# EAGLE board module_Rnx_ctrl (EAGLE 6.5.0)
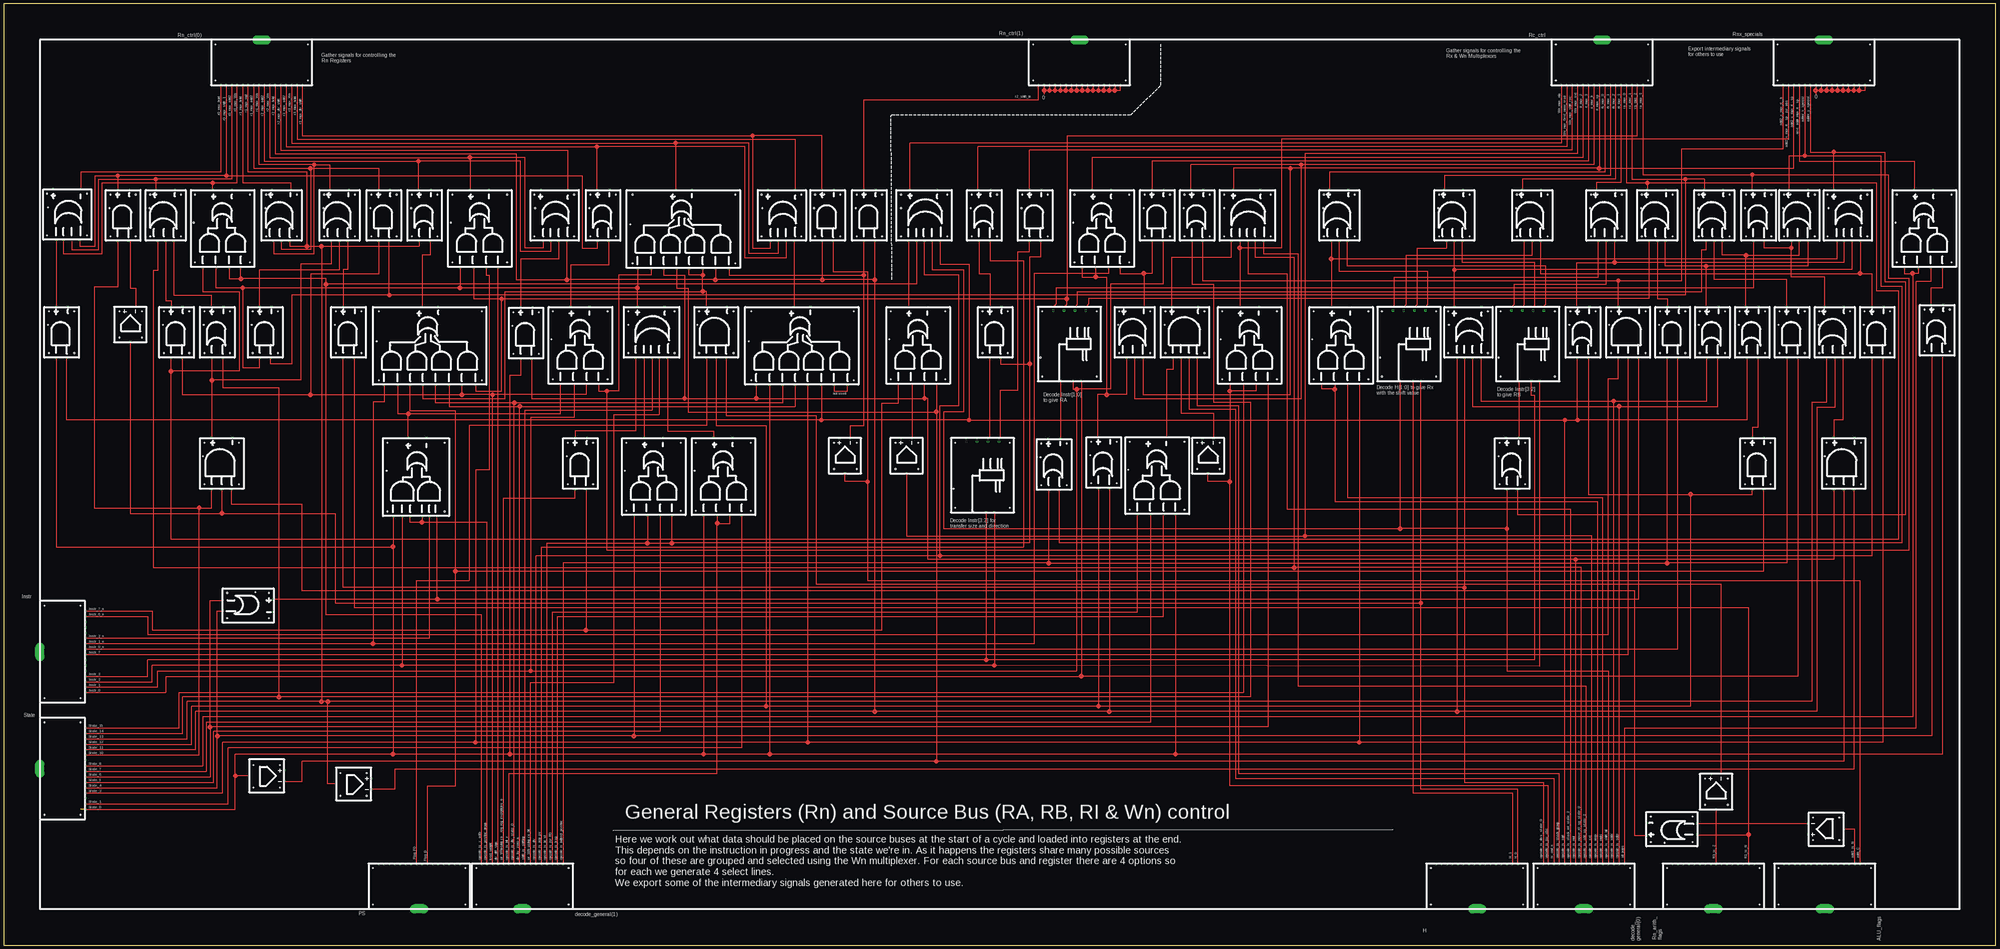
[diagram p21: board, top side]

Size 1397 x 660.4 mm. Coordinates in mm from the lower left corner, seen from the top.
Outline: 0,0 1397,0 1397,660.4 0,660.4 0,0
Copper layers (1*16): Top 0.035mm / dielectric 1.5mm / Bottom 0.035mm
Design rules "default": minimum track width 10mil, minimum drill 24mil, track to track 8mil, track to pad 8mil, pad to pad 8mil, via to via 8mil, smd to smd 8mil, copper to edge 40mil, drill to drill 8mil, minimum pad ring 10mil, minimum via ring 8mil, stop-mask expansion 4mil, vias tented up to drill 0mil, thermal gap 10mil
tKeepout: area 16.3,16.3 to 34.5,34.5; area 1362.5,16.3 to 1380.7,34.5; area 867.2,16.3 to 885.4,34.5; area 16.3,625.9 to 34.5,644.1; area 1362.5,625.9 to 1380.7,644.1; area 867.2,625.9 to 885.4,644.1; area 968.8,625.9 to 987,644.1; area 968.8,16.3 to 987,34.5

## Footprints (pad centres in the part's own frame; a part is rotated, then mirrored left to right if it is on the bottom)
2OR = drill 0.8 square: OUT_M 17.78,-4.445; OUT_P 17.78,4.445; P$1 -17.78,-3.81; P$2 -17.78,3.81 | hole 0.6: -14.605,8.89; 14.605,-8.89; 14.605,8.89; -14.605,-8.89; 5.08,9.525
2X2AND_OR = drill 0.8 square: OUT_M 27.94,-6.985; OUT_P 27.94,6.35; P$1 -26.035,-13.335; P$2 -26.035,-5.08; P$3 -26.035,3.81; P$4 -26.035,13.335 | hole 0.6: -22.86,18.733; 24.765,18.733; -22.86,-19.685; 24.765,-19.685; 5.08,19.685
4OR = drill 0.8 square: 1 -16.51,-8.255; 2 -16.51,-2.54; 3 -16.51,3.175; 4 -16.51,8.255; OUT_M 19.05,-8.89; OUT_P 19.05,10.16 | hole 0.6: -13.335,-13.335; 15.875,-13.335; 15.875,14.605; -13.335,14.605; 6.35,13.97
3OR = drill 0.8 square: OUT_M 16.51,-6.985; OUT_P 16.51,6.35; P$1 -19.05,-6.35; P$2 -19.05,-0.635; P$3 -19.05,5.08 | hole 0.6: -15.875,-11.43; 13.335,-11.43; 13.335,10.16; -15.875,10.16; 3.81,10.795
BUS_SPLIT_DISPLAY = drill 0.8 pad 6.452 long: INPUT 0,15.24 | drill 0.8 square: P$1 -28.575,-16.51; P$2 -24.765,-16.51; P$3 -20.955,-16.51; P$4 -17.145,-16.51; P$5 -13.335,-16.51; P$6 -9.525,-16.51; P$7 -5.715,-16.51; P$8 -1.905,-16.51; P$9 1.905,-16.51; P$10 5.715,-16.51; P$11 9.525,-16.51; P$12 13.335,-16.51; P$13 17.145,-16.51; P$14 20.955,-16.51; P$15 24.765,-16.51; P$16 28.575,-16.51 | hole 0.6: -32.385,-13.335; -32.385,12.065; 32.385,12.065; 32.385,-13.335
5OR = drill 0.8 square: 1 -17.78,-10.795; 2 -17.78,-5.08; 3 -17.78,0; 4 -17.78,5.715; 5 -17.78,11.43; OUT_M 17.78,-8.89; OUT_P 17.78,10.16 | hole 0.6: -14.605,-15.875; 14.605,-15.875; 14.605,16.51; -14.605,16.51; 5.08,16.51
2AND = drill 0.8 square: OUT_M 19.05,-4.445; OUT_P 19.05,3.81; P$1 -16.51,-3.81; P$2 -16.51,3.81 | hole 0.6: -13.335,8.89; 15.875,-8.89; -13.335,-8.89; 15.875,8.89; 6.35,9.525
3AND = drill 0.8 square: OUT_M 16.51,-7.62; OUT_P 16.51,6.985; P$1 -19.05,-6.985; P$2 -19.05,0; P$3 -19.05,6.985 | hole 0.6: -15.875,-12.065; 13.335,-12.065; 13.335,12.065; -15.875,12.065; 3.81,13.335
1BUF = drill 0.8 square: IN -12.7,0; N 12.065,-3.81; P 12.065,3.81 | hole 0.6: -9.525,7.62; -9.525,-8.255; 8.89,-8.255; 8.89,7.62
DECODER4 = drill 0.8 square: A0 -24.765,-7.62; A1 -24.765,-1.905; E -24.765,6.985; N0 24.765,-10.795; N1 24.765,-3.175; N2 24.765,4.445; N3 24.765,12.065; P0 27.305,-10.795; P1 27.305,-3.175; P2 27.305,4.445; P3 27.305,12.065 | hole 0.6: 24.13,19.685; -21.59,19.685; -21.59,-18.415; 24.13,-18.415; -8.255,20.955
2X3AND_OR = drill 0.8 square: OUT_M 27.94,-6.985; OUT_P 27.94,5.715; P$1 -26.67,-14.605; P$2 -26.67,-8.89; P$3 -26.67,-3.81; P$4 -26.67,4.445; P$5 -26.67,10.16; P$6 -26.67,16.51 | hole 0.6: -23.495,-19.685; 24.765,-19.685; 24.765,20.32; -23.495,20.32; 5.08,20.955
4AND = drill 0.8 square: OUT_M 17.145,-8.89; OUT_P 17.145,9.525; P$1 -18.415,-8.255; P$2 -18.415,-2.54; P$3 -18.415,3.175; P$4 -18.415,8.89 | hole 0.6: -15.24,-13.335; 13.97,-13.335; 13.97,13.97; -15.24,13.97; 4.445,14.605
4X2AND_OR = drill 0.8 square: OUT_M 26.67,-6.985; OUT_P 26.67,4.445; P$1 -27.94,-33.02; P$2 -27.94,-23.495; P$3 -27.94,-14.605; P$4 -27.94,-5.08; P$5 -27.94,3.81; P$6 -27.94,12.7; P$7 -27.94,21.59; P$8 -27.94,31.115 | hole 0.6: -24.765,-37.465; 23.495,-37.465; 23.495,34.608; -24.765,34.608; 2.54,36.195

## Placement (x,y rotation side)
CMP1  2OR  [2OR]  771.52,338.45 90 top
CMP2  2X2AND_OR  [2X2AND_OR]  937.26,419.74 90 top
CMP3  4OR  [4OR]  1027.43,428.62 90 top
CMP4  4OR  [4OR]  1293.49,510.54 90 top
CMP5  2X2AND_OR  [2X2AND_OR]  640.72,419.74 90 top
CMP6  2OR  [2OR]  1107.44,429.89 90 top
CMP7  2OR  [2OR]  1057.91,337.82 90 top
CMP8  3OR  [3OR]  935.99,513.08 90 top
CMP9  4OR  [4OR]  45.09,511.18 90 top
CMP10  4OR  [4OR]  386.71,510.54 90 top
CMP11  BUS_SPLIT_DISPLAY  [BUS_SPLIT_DISPLAY]  40.64,205.74 90 top
CMP12  3OR  [3OR]  1016.63,513.08 90 top
CMP13  5OR  [5OR]  645.79,511.81 90 top
CMP14  3OR  [3OR]  1071.24,513.08 90 top
CMP15  2OR  [2OR]  687.71,511.81 90 top
CMP16  2AND  [2AND]  695.33,428.62 90 top
CMP17  2AND  [2AND]  723.26,510.54 90 top
CMP18  BUS_SPLIT_DISPLAY  [BUS_SPLIT_DISPLAY]  40.64,123.83 90 top
CMP19  3OR  [3OR]  1123.32,513.08 90 top
CMP20  2X2AND_OR  [2X2AND_OR]  504.19,327.66 90 top
CMP21  2AND  [2AND]  40.64,428.62 90 top
CMP22  2AND  [2AND]  404.5,336.55 90 top
CMP23  2AND  [2AND]  83.82,510.54 90 top
CMP24  4OR  [4OR]  546.1,510.54 90 top
CMP25  BUS_CONSTRUCT_DISPLAY  [BUS_SPLIT_DISPLAY]  1120.78,619.76 0 top
CMP26  2OR  [2OR]  1198.24,429.89 90 top
CMP27  2OR  [2OR]  1226.18,429.89 90 top
CMP28  3AND  [3AND]  1290.32,339.09 90 top
CMP29  3OR  [3OR]  1283.34,431.17 90 top
CMP30  3OR  [3OR]  1258.57,513.08 90 top
CMP31  1BUF  [1BUF]  88.9,435.61 90 top
CMP32  2OR  [2OR]  736.6,337.19 90 top
CMP33  2AND  [2AND]  1170.31,428.62 90 top
CMP34  2AND  [2AND]  1254.12,428.62 90 top
CMP35  3OR  [3OR]  1158.88,513.08 90 top
CMP36  3OR  [3OR]  1198.88,513.08 90 top
CMP37  2OR  [2OR]  1230.63,511.81 90 top
CMP38  DECODER4  [DECODER4]  1069.34,420.37 90 top
CMP39  DECODER4  [DECODER4]  986.15,420.37 90 top
CMP40  3OR  [3OR]  194.31,513.08 90 top
CMP41  2OR  [2OR]  836.93,511.81 90 top
CMP42  2AND  [2AND]  121.28,428.62 90 top
CMP43  3OR  [3OR]  792.48,431.17 90 top
CMP44  3OR  [3OR]  113.03,513.08 90 top
CMP45  2X2AND_OR  [2X2AND_OR]  769.62,501.65 90 top
CMP46  2AND  [2AND]  808.99,510.54 90 top
CMP47  2OR  [2OR]  171.45,238.12 0 top
CMP48  1BUF  [1BUF]  184.78,118.75 0 top
CMP49  1BUF  [1BUF]  245.75,113.03 0 top
CMP50  2X3AND_OR  [2X3AND_OR]  289.56,327.66 90 top
CMP51  DECODER4  [DECODER4]  748.03,420.37 90 top
CMP52  BUS_CONSTRUCT_DISPLAY  [BUS_SPLIT_DISPLAY]  1276.35,619.76 0 top
CMP53  3AND  [3AND]  499.75,431.17 90 top
CMP54  2AND  [2AND]  266.7,510.54 90 top
CMP55  1BUF  [1BUF]  844.55,343.54 90 top
CMP56  2X2AND_OR  [2X2AND_OR]  153.03,501.65 90 top
CMP57  BUS_SPLIT_DISPLAY  [BUS_SPLIT_DISPLAY]  1108.08,40.64 180 top
CMP58  2X2AND_OR  [2X2AND_OR]  873.12,419.74 90 top
CMP59  2X2AND_OR  [2X2AND_OR]  808.36,328.3 90 top
CMP60  4AND  [4AND]  828.67,430.53 90 top
CMP61  5OR  [5OR]  872.49,511.81 90 top
CMP62  2OR  [2OR]  1355.72,431.17 90 top
CMP63  2OR  [2OR]  1169.67,81.28 180 top
CMP64  2X2AND_OR  [2X2AND_OR]  1346.2,501.65 90 top
CMP65  BUS_SPLIT_DISPLAY  [BUS_SPLIT_DISPLAY]  363.86,40.64 180 top
CMP66  2OR  [2OR]  295.27,511.81 90 top
CMP67  2AND  [2AND]  1229.99,336.55 90 top
CMP68  3OR  [3OR]  234.95,513.08 90 top
CMP69  2AND  [2AND]  183.51,428.62 90 top
CMP70  2X2AND_OR  [2X2AND_OR]  333.38,501.65 90 top
CMP71  2OR  [2OR]  420.37,511.81 90 top
CMP72  3AND  [3AND]  153.03,339.09 90 top
CMP73  2AND  [2AND]  366.39,427.99 90 top
CMP74  2OR  [2OR]  149.86,429.89 90 top
CMP75  2X2AND_OR  [2X2AND_OR]  403.86,419.74 90 top
CMP76  2AND  [2AND]  1313.82,428.62 90 top
CMP77  2AND  [2AND]  577.85,510.54 90 top
CMP78  4X2AND_OR  [4X2AND_OR]  475.62,502.92 90 top
CMP79  4X2AND_OR  [4X2AND_OR]  558.8,421 90 top
CMP80  2X2AND_OR  [2X2AND_OR]  455.3,327.66 90 top
CMP81  4X2AND_OR  [4X2AND_OR]  297.81,421 90 top
CMP82  5OR  [5OR]  454.66,429.89 90 top
CMP83  1BUF  [1BUF]  633.1,343.54 90 top
CMP84  2AND  [2AND]  241.94,428.62 90 top
CMP85  3AND  [3AND]  1139.19,431.17 90 top
CMP86  BUS_SPLIT_DISPLAY  [BUS_SPLIT_DISPLAY]  1198.88,40.64 180 top
CMP87  BUS_SPLIT_DISPLAY  [BUS_SPLIT_DISPLAY]  291.46,40.64 180 top
CMP88  DECODER4  [DECODER4]  687.07,328.3 90 top
CMP89  BUS_CONSTRUCT_DISPLAY  [BUS_SPLIT_DISPLAY]  754.38,619.76 0 top
CMP90  1BUF  [1BUF]  1200.79,107.95 90 top
CMP91  1BUF  [1BUF]  1277.62,81.28 180 top
CMP92  1BUF  [1BUF]  589.91,343.54 90 top
CMP93  2AND  [2AND]  607.06,510.54 90 top
CMP96  BUS_SPLIT_DISPLAY  [BUS_SPLIT_DISPLAY]  1033.14,40.64 180 top
CMP97  BUS_SPLIT_DISPLAY  [BUS_SPLIT_DISPLAY]  1276.98,40.64 180 top
CMP99  BUS_CONSTRUCT_DISPLAY  [BUS_SPLIT_DISPLAY]  180.97,619.76 0 top

## Tracks (layer width: path | path; a pad name or v marks a point on that pad's centre or on a via)
ADD1_RESULT_IS_N
  Top 0.61: CMP97.P$3 1297.94,81.28 CMP91.IN
ADD1_RESULT_IS_P
  Top 0.61: CMP91.N CMP63.P$1
ADD2_X_MUX_RI__H
  Top 0.61: CMP85.OUT_P 1132.2,466.09 | 1132.2,466.09 1176.65,466.09 1176.65,558.8 1247.78,558.8 CMP52.P$1 | CMP41.P$1 840.74,466.09 1132.2,466.09
ADD2_X_MUX_RI__SP
  Top 0.61: CMP25.P$8 1118.87,544.83 | 1118.87,544.83 1255.39,544.83 CMP52.P$3 | 1118.87,544.83 902.34,544.83 | 902.34,544.83 862.33,544.83 CMP61.OUT_P | CMP43.P$1 798.83,386.08 902.34,386.08 902.34,544.83
ADD2_X_MUX_RI__SP__JSR_ABS
  Top 0.61: CMP61.4 866.77,488.95 | 866.77,488.95 CMP58.OUT_P | CMP52.P$2 1251.59,565.15 895.99,565.15 895.99,488.95 866.77,488.95
ADD2_X_MUX_RI__SP__STACK
  Top 0.61: CMP60.OUT_P 819.15,482.6 861.06,482.6 CMP61.5
ADD2_X_MUX_RI_SP__STACK_SET_A_N
  Top 0.61: CMP60.P$4 819.78,403.86 815.34,403.86 CMP59.OUT_M
ADDER_X_MUX_R0
  Top 0.61: CMP26.OUT_P 1193.8,476.25 | 1193.8,476.25 1165.22,476.25 CMP35.P$1 | CMP30.P$1 1264.92,476.25 1193.8,476.25
ADDER_X_MUX_R1
  Top 0.61: CMP27.OUT_P 1221.74,483.87 | 1221.74,483.87 1205.23,483.87 CMP36.P$1 | 1221.74,483.87 1259.2,483.87 CMP30.P$2
ADDER_X_MUX_R1__DIV
  Top 0.61: CMP27.P$1 1229.99,363.22 1226.18,363.22 CMP67.OUT_P
ADDER_X_MUX_R3
  Top 0.61: CMP30.P$3 1253.49,488.95 | 1253.49,488.95 1234.44,488.95 CMP37.P$1 | CMP29.OUT_P 1276.98,468.63 1253.49,468.63 1253.49,488.95
ADDER_X_MUX_R3_SET_A
  Top 0.61: CMP29.P$1 1289.68,368.3 1283.34,368.3 CMP28.OUT_P
ADDER_X_MUX_SPECIAL
  Top 0.61: CMP52.P$5 1263.02,553.72 | 1263.02,553.72 1316.36,553.72 1316.36,462.28 1330.96,462.28 1330.96,281.94 740.41,281.94 CMP32.P$1 | CMP30.OUT_P 1252.22,553.72 1263.02,553.72
ADDER_Y_MUX_R0
  Top 0.61: CMP8.P$3 930.91,481.33 | 930.91,481.33 CMP2.OUT_P | CMP4.4 1285.24,481.33 930.91,481.33
ADDER_Y_MUX_R1
  Top 0.61: CMP4.2 1296.04,473.71 1017.27,473.71 | 1017.27,473.71 CMP12.P$2 | CMP3.OUT_P 1017.27,473.71
ADDER_Y_MUX_R2__DIV
  Top 0.61: CMP4.1 1301.75,471.17 | 1301.75,471.17 1310.01,471.17 CMP76.OUT_P | CMP14.P$1 1077.6,471.17 1301.75,471.17
ADDER_Y_MUX_R3
  Top 0.61: CMP4.3 1290.32,478.79 1129.66,478.79 | 1129.66,478.79 CMP19.P$1 | CMP6.OUT_P 1102.99,478.79 1129.66,478.79
ADDER_Y_MUX_SPECIAL
  Top 0.61: CMP52.P$6 1266.83,556.26 1283.34,556.26 | 1283.34,556.26 1318.89,556.26 1318.89,465.45 1333.5,465.45 1333.5,301.62 1061.72,301.62 CMP7.P$1 | CMP4.OUT_P 1283.34,556.26
ALL_POPS
  Top 0.61: CMP64.P$2 1351.28,465.45 1341.12,465.45 1341.12,152.4 1136.65,152.4 CMP57.P$1
ARITH_C
  Top 0.61: CMP77.P$1 581.66,472.44 605.79,472.44 605.79,325.12 | 605.79,325.12 589.91,325.12 CMP92.IN | 605.79,325.12 605.79,255.91 1301.75,255.91 CMP97.P$2
ARITH_C_N
  Top 0.61: CMP78.P$1 508.63,469.9 603.25,469.9 | 603.25,469.9 CMP93.P$2 | CMP92.N 593.73,364.49 603.25,364.49 603.25,469.9
DIR_SZ_IS_LOAD_BYTE
  Top 0.61: CMP88.P1 691.51,356.87 CMP16.P$2
DIR_SZ_IS_LOAD_WORD
  Top 0.61: CMP88.P0 699.13,356.87 699.13,389.25 711.2,389.25 711.2,486.41 719.46,486.41 CMP17.P$2
DIV_BY_ZERO_N
  Top 0.61: CMP79.P$5 554.99,377.82 361.95,377.82 | CMP81.P$3 312.42,377.82 361.95,377.82 | CMP65.P$9 361.95,377.82
DIV_DIFF_SIGN
  Top 0.61: CMP65.P$13 CMP70.P$1
DIV_SGN_STATE12_NZ_REM
  Top 0.61: CMP78.P$3 490.22,469.9 | 490.22,469.9 480.69,469.9 CMP78.P$4 | CMP53.OUT_P 492.76,458.47 490.22,458.47 | 490.22,458.47 490.22,469.9 | CMP81.P$5 294,383.54 351.79,383.54 351.79,458.47 490.22,458.47
FLAG_D
  Top 0.61: CMP67.P$1 1233.81,262.25 316.87,262.25 | 316.87,262.25 316.87,374.65 285.12,374.65 CMP81.P$6 | CMP87.P$7 297.18,111.76 316.87,111.76 316.87,262.25
FLAG_F0
  Top 0.61: CMP53.P$3 492.76,364.49 326.39,364.49 326.39,255.91 289.56,255.91 CMP87.P$9
H_0
  Top 0.61: CMP96.P$1 1061.72,109.22 993.77,109.22 993.77,240.03 | 993.77,240.03 CMP39.A0 | CMP72.P$2 153.03,302.89 | 153.03,302.89 232.41,302.89 232.41,240.03 993.77,240.03 | CMP31.IN 88.9,302.89 153.03,302.89
H_0_N
  Top 0.61: CMP23.P$1 88.9,494.03 88.9,461.01 92.71,461.01 CMP31.N
H_1
  Top 0.61: CMP39.A1 988.06,106.68 1057.91,106.68 CMP96.P$2
INSTR_0
  Top 0.61: CMP11.P$1 113.67,177.16 113.67,188.59 755.65,188.59 | CMP51.A0 755.65,188.59 | CMP34.P$1 1257.93,188.59 755.65,188.59
INSTR_0_N
  Top 0.61: CMP11.P$9 1174.12,207.65 CMP33.P$1
INSTR_1
  Top 0.61: CMP11.P$2 107.95,180.97 107.95,192.41 369.57,192.41 | CMP51.A1 749.93,389.89 752.48,389.89 | 752.48,389.89 752.48,192.41 369.57,192.41 | CMP46.P$1 812.8,463.55 775.97,463.55 775.97,389.89 752.48,389.89 | CMP75.P$3 400.05,370.2 369.57,370.2 369.57,192.41
INSTR_1_N
  Top 0.61: 259.08,211.46 722.63,211.46 722.63,471.17 774.7,471.17 CMP45.P$2 | 259.08,211.46 CMP11.P$10 | CMP81.P$8 266.7,381 259.08,381 259.08,211.46
INSTR_2
  Top 0.61: 694.69,196.22 1076.96,195.58 CMP38.A0 | 694.69,196.22 279.4,196.22 | 279.4,196.22 104.14,196.22 104.14,184.78 CMP11.P$3 | CMP88.A0 694.69,196.22 | CMP50.P$5 279.4,196.22
INSTR_2_N
  Top 0.61: CMP50.P$2 298.45,215.26 CMP11.P$11
INSTR_3
  Top 0.61: 688.98,200.03 1073.79,200.03 1073.79,385.44 1071.24,385.44 CMP38.A1 | 688.98,200.03 100.97,200.03 100.97,188.59 CMP11.P$4 | CMP88.A1 688.98,200.03
INSTR_6_N
  Top 0.61: CMP11.P$15 100.97,230.5 100.97,217.81 1125.22,217.81 1125.22,397.51 1132.2,397.51 CMP85.P$3
INSTR_7
  Top 0.61: CMP11.P$8 1139.19,203.84 CMP85.P$2
INSTR_7_N
  Top 0.61: CMP11.P$16 104.14,234.31 104.14,220.98 408.31,220.98 | 408.31,220.98 615.95,220.98 615.95,380.37 627.38,380.37 CMP5.P$4 | CMP22.P$1 408.31,220.98
IS_END_N
  Top 0.61: CMP60.P$2 831.22,375.92 863.6,375.92 863.6,116.84 1087.12,116.84 CMP57.P$14
IS_STATE_0_4
  Top 0.61: CMP64.P$1 1359.54,461.01 1351.28,461.01 CMP62.OUT_P
IS_STATE_4_6
  Top 0.61: CMP85.P$1 1146.17,242.57 304.17,242.57 | 304.17,242.57 304.17,299.72 303.53,300.36 CMP50.P$1 | 304.17,242.57 CMP47.OUT_P
LOAD_WEIGHT
  Top 0.61: CMP42.P$1 125.09,386.08 215.26,386.08 | 215.26,386.08 321.31,386.08 | CMP75.P$2 408.94,386.08 342.9,386.08 | CMP54.P$2 262.89,470.54 215.26,470.54 215.26,386.08 | CMP81.P$2 321.31,386.08 | 342.9,386.08 321.31,386.08 | CMP65.P$14 342.9,386.08
MAIN_RN_INPUT_MUX_0XT_READ
  Top 0.61: CMP25.P$2 1096.01,560.07 683.26,560.07 CMP15.OUT_P
MAIN_RN_INPUT_MUX_0XT_READ__LOAD_BYTE
  Top 0.61: CMP15.P$2 683.89,471.17 691.51,471.17 CMP16.OUT_P
MAIN_RN_INPUT_MUX_ALU
  Top 0.61: CMP25.P$1 1092.2,562.61 635.63,562.61 CMP13.OUT_P
MAIN_RN_INPUT_MUX_ALU__SET_A
  Top 0.61: CMP13.5 CMP5.OUT_P
MAIN_RN_INPUT_MUX_SHIFT_RAC
  Top 0.61: CMP25.P$3 1099.82,557.53 719.46,557.53 CMP17.OUT_P
N$2
  Top 0.61: CMP52.P$7 1270.63,599.44 | 1270.63,599.44 1270.63,596.9 | CMP52.P$16 1304.92,599.44 1301.12,599.44 | 1301.12,599.44 1297.31,599.44 | 1297.31,599.44 1293.49,599.44 | 1293.49,599.44 1289.68,599.44 | 1289.68,599.44 1285.88,599.44 | 1285.88,599.44 1282.07,599.44 | 1282.07,599.44 1278.26,599.44 | 1278.26,599.44 1274.44,599.44 | 1274.44,599.44 1270.63,599.44 | CMP52.P$8 1274.44,599.44 | CMP52.P$9 1278.26,599.44 | CMP52.P$10 1282.07,599.44 | CMP52.P$11 1285.88,599.44 | CMP52.P$12 1289.68,599.44 | CMP52.P$13 1293.49,599.44 | CMP52.P$14 1297.31,599.44 | CMP52.P$15 1301.12,599.44
N$3
  Top 0.61: CMP89.P$2 729.62,599.44 | 729.62,599.44 729.62,596.9 | CMP89.P$3 733.42,599.44 | 733.42,599.44 729.62,599.44 | CMP89.P$16 782.96,599.44 779.14,599.44 | 779.14,599.44 775.34,599.44 | 775.34,599.44 771.52,599.44 | 771.52,599.44 767.72,599.44 | 767.72,599.44 763.9,599.44 | 763.9,599.44 760.1,599.44 | 760.1,599.44 756.28,599.44 | 756.28,599.44 752.48,599.44 | 752.48,599.44 748.66,599.44 | 748.66,599.44 744.86,599.44 | 744.86,599.44 741.04,599.44 | 741.04,599.44 737.24,599.44 | 737.24,599.44 733.42,599.44 | CMP89.P$4 737.24,599.44 | CMP89.P$5 741.04,599.44 | CMP89.P$6 744.86,599.44 | CMP89.P$7 748.66,599.44 | CMP89.P$8 752.48,599.44 | CMP89.P$9 756.28,599.44 | CMP89.P$10 760.1,599.44 | CMP89.P$11 763.9,599.44 | CMP89.P$12 767.72,599.44 | CMP89.P$13 771.52,599.44 | CMP89.P$14 775.34,599.44 | CMP89.P$15 779.14,599.44
N$34
  Top 0.61: CMP79.P$2 582.29,388.62 591.82,388.62 CMP79.P$1
NEXT_ADDR_MUX_RI__SP
  Top 0.61: CMP52.P$4 1259.2,549.91 1339.85,549.91 CMP64.OUT_P
NEXT_R0_MUX_ADD2
  Top 0.61: CMP99.P$3 160.02,537.21 106.68,537.21 | CMP9.2 47.62,487.68 66.67,487.68 66.67,537.21 106.68,537.21 | 106.68,537.21 CMP44.OUT_P
NEXT_R0_MUX_ADD2__WEIGHT
  Top 0.61: CMP44.P$2 113.67,452.12 117.47,452.12 CMP42.OUT_P
NEXT_R0_MUX_HOLD
  Top 0.61: CMP99.P$1 152.4,542.29 53.98,542.29 CMP9.OUT_M
NEXT_R0_MUX_MAIN
  Top 0.61: CMP56.OUT_P 146.69,534.67 | 146.69,534.67 163.83,534.67 CMP99.P$4 | CMP9.3 41.91,485.14 69.22,485.14 69.22,534.67 146.69,534.67
NEXT_R1_MUX_ADD2
  Top 0.61: CMP99.P$7 175.26,544.83 215.26,544.83 | 215.26,544.83 215.26,487.68 194.94,487.68 CMP40.P$2 | 215.26,544.83 262.89,544.83 CMP54.OUT_P
NEXT_R1_MUX_HOLD
  Top 0.61: CMP99.P$5 167.64,534.67 201.29,534.67 CMP40.OUT_M
NEXT_R1_MUX_MAIN
  Top 0.61: CMP40.P$3 189.23,485.14 217.81,485.14 217.81,547.37 | 217.81,547.37 179.07,547.37 CMP99.P$8 | 217.81,547.37 228.6,547.37 CMP68.OUT_P
NEXT_R1_MUX_MAIN__DIV
  Top 0.61: CMP68.P$1 241.3,473.71 238.12,473.71 CMP84.OUT_P
NEXT_R1_MUX_MAIN__RAC
  Top 0.61: CMP69.OUT_P 179.71,473.71 235.59,473.71 CMP68.P$2
NEXT_R2_MUX_ADD2
  Top 0.61: CMP99.P$9 182.88,549.91 290.83,549.91 | 290.83,549.91 CMP66.OUT_P | CMP10.3 383.54,486.41 362.58,486.41 362.58,549.91 290.83,549.91
NEXT_R2_MUX_ADD2__A
  Top 0.61: CMP66.P$1 299.08,483.87 293.37,483.87 CMP81.OUT_P
NEXT_R2_MUX_CLEAR
  Top 0.61: CMP10.2 389.25,481.33 362.58,481.33 CMP73.OUT_P
NEXT_R2_MUX_HOLD
  Top 0.61: CMP99.P$12 194.31,557.53 395.61,557.53 CMP10.OUT_M
NEXT_R2_MUX_MAIN
  Top 0.61: CMP99.P$10 186.69,552.45 327.02,552.45 | 327.02,552.45 CMP70.OUT_P | CMP10.4 378.46,488.95 365.76,488.95 365.76,552.45 327.02,552.45
NEXT_R3_MUX_ADD2
  Top 0.61: CMP99.P$13 198.12,560.07 415.93,560.07 | 415.93,560.07 CMP71.OUT_P | CMP24.2 548.64,481.96 520.07,481.96 520.07,560.07 415.93,560.07
NEXT_R3_MUX_ADD2__A
  Top 0.61: CMP71.P$1 424.18,476.88 397.51,476.88 CMP75.OUT_P
NEXT_R3_MUX_CLEAR
  Top 0.61: CMP24.1 CMP79.OUT_P
NEXT_R3_MUX_DIV_SHIFT_R3
  Top 0.61: CMP99.P$16 209.55,567.69 525.14,567.69 | 525.14,567.69 525.14,488.95 537.85,488.95 CMP24.4 | CMP77.OUT_P 574.04,567.69 525.14,567.69
NEXT_R3_MUX_HOLD
  Top 0.61: CMP99.P$15 205.74,565.15 554.99,565.15 CMP24.OUT_M
NEXT_R3_MUX_MAIN
  Top 0.61: CMP99.P$14 201.93,562.61 471.17,562.61 | 471.17,562.61 CMP78.OUT_P | CMP24.3 542.92,485.14 522.61,485.14 522.61,562.61 471.17,562.61
OPCODE_IS_ADD_SP_STATE_2
  Top 0.61: CMP61.1 883.28,485.14 907.41,485.14 907.41,181.61 1109.98,181.61 CMP57.P$8
OPCODE_IS_ADDX
  Top 0.61: CMP3.1 1035.68,381.63 1129.03,381.63 | 1129.03,381.63 1194.43,381.63 CMP26.P$2 | CMP57.P$3 1129.03,381.63
OPCODE_IS_DIV
  Top 0.61: CMP76.P$2 1310.01,273.05 656.59,273.05 | 656.59,273.05 656.59,378.46 669.92,378.46 669.92,469.9 645.79,469.9 CMP13.3 | 656.59,273.05 373.38,273.05 CMP65.P$6
OPCODE_IS_DIV_STATE_0
  Top 0.61: CMP79.P$6 546.1,380.37 358.14,380.37 | 358.14,380.37 302.89,380.37 CMP81.P$4 | CMP65.P$10 358.14,380.37
OPCODE_IS_DIVS_STATE_0
  Top 0.61: CMP3.3 1024.26,250.82 | 1024.26,250.82 238.12,250.82 CMP84.P$2 | 1024.26,250.82 1024.26,114.3 1079.5,114.3 CMP57.P$16
OPCODE_IS_INDIRECT_POSTINC
  Top 0.61: CMP32.P$2 732.79,267.97 | 732.79,267.97 1166.49,267.97 | 1166.49,267.97 CMP33.P$2 | CMP34.P$2 1250.32,267.97 1166.49,267.97 | 732.79,267.97 392.43,267.97 CMP65.P$1
OPCODE_IS_JSR_ABS
  Top 0.61: CMP58.P$4 859.79,388.62 | 859.79,388.62 859.79,325.12 | 859.79,325.12 844.55,325.12 CMP55.IN | CMP58.P$2 878.21,388.62 859.79,388.62 | CMP57.P$15 1083.31,111.76 859.79,111.76 859.79,325.12
OPCODE_IS_JSR_ABS_N
  Top 0.61: CMP60.P$3 825.5,373.38 848.36,373.38 CMP55.N
OPCODE_IS_JSR_R0
  Top 0.61: CMP65.P$3 384.81,233.68 795.02,233.68 CMP59.P$4
OPCODE_IS_LD_ST
  Top 0.61: CMP17.P$1 727.08,482.6 719.46,482.6 719.46,407.67 | 719.46,407.67 719.46,281.94 468.63,281.94 | 468.63,281.94 CMP80.P$1 | CMP16.P$1 699.13,407.67 719.46,407.67 | CMP80.P$3 451.49,281.94 | 451.49,281.94 468.63,281.94 | CMP65.P$4 381,281.94 451.49,281.94
OPCODE_IS_LDI_X
  Top 0.61: CMP20.P$3 500.38,295.91 | 500.38,295.91 509.27,295.91 CMP20.P$2 | CMP65.P$11 354.33,120.65 500.38,120.65 500.38,295.91
OPCODE_IS_MOVE_R0_SP_STATE_0
  Top 0.61: CMP61.2 877.57,482.6 904.88,482.6 904.88,264.8 | CMP44.P$3 107.95,473.07 104.78,473.07 104.78,264.8 904.88,264.8 | CMP57.P$9 1106.17,264.8 904.88,264.8
OPCODE_IS_MUL
  Top 0.61: CMP28.P$3 1283.34,270.51 1102.36,270.51 | 1102.36,270.51 648.34,270.51 648.34,383.54 645.79,383.54 | 645.79,383.54 CMP5.P$2 | CMP79.P$8 527.68,383.54 | 527.68,383.54 645.79,383.54 | CMP73.P$1 370.2,383.54 477.52,383.54 | 477.52,383.54 527.68,383.54 | CMP78.P$6 462.92,469.9 477.52,469.9 477.52,383.54 | CMP57.P$10 1102.36,270.51
OPCODE_IS_MULS
  Top 0.61: CMP2.P$2 942.34,313.69 1121.41,313.69 CMP57.P$5
OPCODE_IS_NEGX
  Top 0.61: CMP2.P$4 923.92,389.89 933.45,389.89 | CMP2.P$3 933.45,389.89 | 933.45,389.89 933.45,311.15 1117.6,311.15 CMP57.P$6
OPCODE_IS_POP_PS
  Top 0.61: CMP15.P$1 691.51,480.06 715.01,480.06 715.01,279.4 377.19,279.4 CMP65.P$5
OPCODE_IS_POSTINC_GROUP
  Top 0.61: 293.37,296.55 285.12,296.55 CMP50.P$4 | CMP50.P$3 293.37,296.55 | CMP65.P$15 339.09,296.55 293.37,296.55
OPCODE_IS_SHIFT_BIT
  Top 0.61: CMP39.E 979.17,292.1 | CMP7.P$2 1054.1,292.1 | 1054.1,292.1 979.17,292.1 | CMP13.2 650.88,473.71 673.1,473.71 673.1,374.01 659.13,374.01 659.13,292.1 979.17,292.1 | 1054.1,292.1 1054.1,192.41 1125.22,192.41 CMP57.P$4
OPCODE_IS_SQRT
  Top 0.61: CMP13.1 656.59,477.52 676.91,477.52 676.91,368.3 | 676.91,368.3 1094.74,368.3 | 1094.74,368.3 1103.63,368.3 | 1103.63,368.3 CMP6.P$2 | 676.91,368.3 573.4,368.3 | 573.4,368.3 44.45,368.3 CMP21.P$1 | CMP79.P$3 573.4,368.3 | CMP27.P$2 1222.38,368.3 1103.63,368.3 | CMP57.P$12 1094.74,368.3
OPCODE_IS_STACK_GROUP
  Top 0.61: CMP60.P$1 836.93,378.46 866.14,378.46 866.14,120.02 1090.93,120.02 CMP57.P$13
OPCODE_IS_STACK_REL_STATE_2
  Top 0.61: CMP61.3 872.49,471.17 899.79,471.17 899.79,306.07 1098.55,306.07 CMP57.P$11
OPCODE_IS_SUBX
  Top 0.61: CMP3.2 1029.97,377.82 1132.84,377.82 | 1132.84,377.82 1202.06,377.82 CMP26.P$1 | CMP57.P$2 1132.84,377.82
OPCODE_IS_SXT
  Top 0.61: CMP25.P$4 1103.63,554.99 912.5,554.99 912.5,287.02 | CMP83.IN 633.1,287.02 912.5,287.02 | CMP57.P$7 1113.79,287.02 912.5,287.02
OPCODE_IS_SXT_N
  Top 0.61: CMP5.P$3 CMP83.N
OPCODE_IS_TRAP
  Top 0.61: CMP65.P$2 388.62,230.5 813.43,230.5 CMP59.P$2
OPCODE_IS_X_ARITH
  Top 0.61: CMP13.4 640.08,463.55 226.06,463.55 | 166.37,467.36 CMP56.P$1 | CMP56.P$2 158.12,467.36 166.37,467.36 | 226.06,463.55 226.06,467.36 166.37,467.36 | CMP65.P$16 335.28,231.78 226.06,231.78 226.06,463.55
R1_IS_N
  Top 0.61: CMP84.P$1 245.75,236.85 1223.64,236.85 1223.64,77.47 | CMP86.P$2 1223.64,77.47 | CMP63.P$2 1223.64,77.47
R2_SHIFT_IN
  Top 0.61: CMP93.OUT_P 603.25,593.09 725.8,593.09 CMP89.P$1
R3_IS_NZ
  Top 0.61: CMP53.P$1 506.73,371.48 569.6,371.48 569.6,253.37 1204.6,253.37 CMP90.N
R3_IS_Z
  Top 0.61: CMP86.P$8 CMP90.IN
RA_MUX_0_RC
  Top 0.61: CMP35.P$2 1159.51,453.39 1166.49,453.39 CMP33.OUT_P
RA_MUX_1_RC
  Top 0.61: CMP34.OUT_P 1250.32,466.73 1199.52,466.73 CMP36.P$2
RA_MUX_NORM_EN
  Top 0.61: CMP51.E CMP32.OUT_M
RA_NORM_0
  Top 0.61: CMP35.P$3 1153.8,453.39 760.73,453.39 760.73,449.58 CMP51.P0
RA_NORM_1
  Top 0.61: CMP51.P1 753.11,449.58 753.11,458.47 1190.62,458.47 1190.62,487.68 1193.8,487.68 CMP36.P$3
RA_NORM_2
  Top 0.61: CMP51.P2 745.49,449.58 745.49,453.39 | CMP25.P$15 1145.54,567.69 745.49,567.69 745.49,453.39 | CMP70.P$3 329.56,453.39 349.25,453.39 | 349.25,453.39 745.49,453.39 | CMP81.P$1 330.83,388.62 349.25,388.62 349.25,453.39
RA_NORM_3
  Top 0.61: CMP37.P$2 1226.82,461.01 737.87,461.01 737.87,449.58 CMP51.P3
RAC_MUX_0
  Top 0.61: CMP56.P$4 139.7,458.47 165.1,458.47 165.1,402.59 117.47,402.59 | 117.47,402.59 CMP42.P$2 | CMP25.P$13 1137.92,534.67 1152.53,534.67 | 1152.53,534.67 CMP35.OUT_P | 1152.53,534.67 1313.18,534.67 1313.18,459.11 1328.42,459.11 1328.42,284.48 117.47,284.48 117.47,402.59
RAC_MUX_1
  Top 0.61: CMP25.P$14 1141.73,537.21 1179.19,537.21 | CMP36.OUT_P 1192.53,537.21 1179.19,537.21 | 1179.19,537.21 1179.19,455.93 270.51,455.93 | 270.51,455.93 CMP54.P$1 | 270.51,455.93 201.93,455.93 201.93,407.67 187.32,407.67 CMP69.P$1
RAC_MUX_3
  Top 0.61: CMP25.P$16 1149.35,540.38 1226.18,540.38 | 1226.18,540.38 1321.43,540.38 1321.43,468 1336.04,468 1336.04,276.86 422.91,276.86 422.91,388.62 | CMP75.P$1 417.19,388.62 422.91,388.62 | CMP37.OUT_P 1226.18,540.38 | CMP78.P$7 454.02,469.9 431.17,469.9 431.17,388.62 422.91,388.62
RB_MUX_0
  Top 0.61: CMP25.P$9 1122.68,542.29 929.64,542.29 CMP8.OUT_P
RB_MUX_1
  Top 0.61: CMP25.P$10 1126.49,539.75 1010.28,539.75 CMP12.OUT_P
RB_MUX_2
  Top 0.61: CMP25.P$11 1130.3,537.21 1064.89,537.21 CMP14.OUT_P
RB_MUX_3
  Top 0.61: CMP25.P$12 1134.11,534.67 1116.96,534.67 CMP19.OUT_P
RB_MUX_NORM_EN
  Top 0.61: CMP38.E CMP7.OUT_M
RB_NORM_0
  Top 0.61: CMP38.P0 1080.13,448.31 1081.4,449.58 1081.4,476.25 942.34,476.25 CMP8.P$1
RB_NORM_1
  Top 0.61: CMP38.P1 1073.79,448.94 1073.79,478.79 1022.99,478.79 CMP12.P$1
RB_NORM_2
  Top 0.61: CMP14.P$3 1066.16,448.94 CMP38.P2
RB_NORM_3
  Top 0.61: CMP38.P3 1059.18,449.58 1059.18,463.55 1123.95,463.55 CMP19.P$2
RB_SHIFT_0
  Top 0.61: CMP39.P0 998.86,449.58 998.86,472.44 936.62,472.44 CMP8.P$2
RB_SHIFT_1
  Top 0.61: CMP12.P$3 1011.55,488.95 991.24,488.95 991.24,449.58 CMP39.P1
RB_SHIFT_2
  Top 0.61: CMP39.P2 983.62,449.58 983.62,483.87 1071.88,483.87 CMP14.P$2
RB_SHIFT_3
  Top 0.61: CMP39.P3 975.36,448.94 975.36,468.63 1118.23,468.63 CMP19.P$3
RI_MUX_2_QUAL
  Top 0.61: CMP25.P$5 1107.44,552.45 763.27,552.45 CMP45.OUT_P
RI_MUX_3_QUAL
  Top 0.61: CMP25.P$6 1111.25,549.91 805.18,549.91 CMP46.OUT_P
RI_MUX_H
  Top 0.61: CMP25.P$7 1115.06,547.37 909.96,547.37 | 909.96,547.37 832.49,547.37 CMP41.OUT_P | CMP43.P$2 793.12,383.54 909.96,383.54 909.96,547.37
RI_MUX_R2
  Top 0.61: CMP45.P$4 756.28,468.63 765.81,468.63 | 765.81,468.63 CMP45.P$3 | 765.81,468.63 773.43,468.63 773.43,386.08 | 773.43,386.08 767.08,386.08 CMP1.OUT_P | CMP43.P$3 787.4,386.08 773.43,386.08
RI_MUX_SPECIAL_N
  Top 0.61: CMP46.P$2 805.18,471.17 799.47,471.17 | 799.47,471.17 CMP43.OUT_M | CMP45.P$1 782.96,471.17 799.47,471.17
SHIFT_IS_SHIFTING
  Top 0.61: CMP82.3 454.66,375.29 365.76,375.29 CMP65.P$8
SQRT_CONDITIONAL
  Top 0.61: CMP63.OUT_P 1143.63,76.83 1143.63,248.28 209.55,248.28 209.55,309.25 160.02,309.25 CMP72.P$1
SQRT_ODD_CONDITIONAL
  Top 0.61: CMP74.P$2 146.05,396.24 | 146.05,396.24 CMP72.OUT_P | CMP68.P$3 229.87,477.52 208.28,477.52 208.28,396.24 146.05,396.24
SQRT_ODD_CONDITIONAL_MUL_14
  Top 0.61: CMP44.P$1 119.38,455.93 145.41,455.93 CMP74.OUT_P
SQRT_STATE_0
  Top 0.61: CMP9.4 CMP21.OUT_P
SQRT_STATE_10_EVEN_CYCLE
  Top 0.61: CMP9.1 53.34,490.22 64.14,490.22 64.14,539.75 80.01,539.75 | 80.01,539.75 CMP23.OUT_P | CMP99.P$2 156.21,539.75 | 156.21,539.75 80.01,539.75 | 156.21,539.75 405.76,539.75 405.76,488.95 416.56,488.95 CMP71.P$2
STATE_0  (1 unrouted)
  Top 0.61: 821.69,133.99 1359.54,133.99 CMP62.P$1 | 821.69,133.99 537.21,133.99 | 537.21,133.99 490.86,133.99 | 490.86,133.99 354.96,133.99 | 354.96,133.99 273.05,133.99 | 273.05,133.99 162.56,133.99 162.56,118.75 | CMP18.P$1 162.56,95.25 162.56,118.75 | CMP73.P$2 362.58,399.42 354.96,399.42 354.96,133.99 | CMP50.P$6 273.05,279.4 | 273.05,279.4 273.05,133.99 | CMP79.P$7 537.21,133.99 | CMP20.P$4 490.86,133.99 | CMP59.P$1 821.69,133.99 | CMP21.P$2 36.83,279.4 273.05,279.4 | CMP48.IN 162.56,118.75
STATE_0_N
  Top 0.61: 654.05,128.91 1290.32,128.91 CMP28.P$2 | 654.05,128.91 209.55,128.91 209.55,114.94 CMP48.N | CMP78.P$5 471.81,461.01 480.06,461.01 480.06,374.01 654.05,374.01 | 654.05,374.01 654.05,128.91 | CMP5.P$1 654.05,374.01
STATE_1
  Top 0.61: CMP18.P$2 157.48,99.06 157.48,138.43 517.52,138.43 CMP20.P$1
STATE_3
  Top 0.61: 950.6,142.24 1317.62,142.24 CMP76.P$1 | 950.6,142.24 563.88,142.24 | 563.88,142.24 330.83,142.24 | 330.83,142.24 153.67,142.24 153.67,106.68 CMP18.P$4 | CMP2.P$1 950.6,142.24 | CMP70.P$2 338.45,469.9 340.36,469.9 340.36,333.38 330.83,333.38 330.83,142.24 | CMP79.P$4 563.88,142.24
STATE_4
  Top 0.61: 441.96,146.69 1351.91,146.69 CMP62.P$2 | 441.96,146.69 149.86,146.69 | CMP18.P$5 149.86,110.49 149.86,146.69 | CMP80.P$4 441.96,146.69 | 149.86,146.69 149.86,234.31 CMP47.P$1
STATE_5
  Top 0.61: CMP18.P$6 147.32,114.3 147.32,149.86 460.38,149.86 CMP80.P$2
STATE_6
  Top 0.61: 144.78,153.03 886.46,153.03 CMP58.P$1 | CMP18.P$7 144.78,118.11 144.78,153.03 | 144.78,153.03 144.78,241.94 CMP47.P$2
STATE_7
  Top 0.61: CMP18.P$8 142.24,121.92 142.24,156.21 804.54,156.21 CMP59.P$3
STATE_8
  Top 0.61: CMP64.P$4 1332.87,471.17 1338.58,471.17 | 1338.58,471.17 1338.58,160.02 139.7,160.02 139.7,125.73 CMP18.P$9 | CMP64.P$3 1342.39,471.17 1338.58,471.17
STATE_10
  Top 0.61: CMP18.P$11 137.16,133.35 137.16,306.7 | CMP23.P$2 80.01,461.64 63.5,461.64 63.5,306.7 137.16,306.7 | 137.16,306.7 146.05,306.7 CMP72.P$3
STATE_11
  Top 0.61: 1019.17,163.83 775.34,163.83 | 775.34,163.83 610.87,163.83 | 610.87,163.83 134.62,163.83 134.62,137.16 CMP18.P$12 | CMP99.P$11 190.5,554.99 359.41,554.99 359.41,466.73 394.97,466.73 | 394.97,466.73 CMP10.1 | CMP77.P$2 574.04,466.73 | 574.04,466.73 499.11,466.73 | 499.11,466.73 394.97,466.73 | CMP78.P$2 499.11,466.73 | CMP3.4 1019.17,163.83 | CMP93.P$1 610.87,466.73 | 610.87,466.73 574.04,466.73 | 610.87,466.73 610.87,163.83 | CMP1.P$1 775.34,163.83 | CMP29.P$2 1283.97,377.19 1271.27,377.19 1271.27,163.83 1019.17,163.83
STATE_12
  Top 0.61: 767.72,167.64 1183.01,167.64 1183.01,316.23 | 767.72,167.64 534.67,167.64 | 534.67,167.64 132.08,167.64 132.08,140.97 CMP18.P$13 | CMP1.P$2 767.72,167.64 | CMP53.P$2 499.75,364.49 534.67,364.49 534.67,167.64 | 1183.01,316.23 1226.18,316.23 CMP67.P$2 | CMP6.P$1 1111.25,316.23 1183.01,316.23
STATE_13
  Top 0.61: 227.33,170.81 1268.1,170.81 1268.1,381 1278.26,381 CMP29.P$3 | 227.33,170.81 222.88,170.81 | 222.88,170.81 128.91,170.81 128.91,144.78 CMP18.P$14 | CMP40.P$1 200.66,490.22 212.72,490.22 | 212.72,490.22 212.72,542.29 171.45,542.29 CMP99.P$6 | CMP66.P$2 291.46,490.22 222.88,490.22 | 212.72,490.22 222.88,490.22 | 222.88,490.22 222.88,170.81 | CMP49.IN 227.33,113.03 227.33,170.81
STATE_13_N
  Top 0.61: CMP28.P$1 1297.31,123.19 274.32,123.19 274.32,109.22 CMP49.N
STATE_14
  Top 0.61: 193.04,173.99 874.39,173.99 874.39,381 848.36,381 848.36,463.55 833.12,463.55 CMP41.P$2 | 193.04,173.99 125.73,173.99 125.73,148.59 CMP18.P$15 | CMP74.P$1 153.67,391.16 193.04,391.16 193.04,173.99
STATE_15
  Top 0.61: CMP18.P$16 123.19,152.4 123.19,177.16 869.32,177.16 CMP58.P$3
WR_RN_USING_RA__BIT
  Top 0.61: CMP82.2 459.74,372.11 427.99,372.11 427.99,184.15 369.57,184.15 CMP65.P$7
WR_RN_USING_RA__LDI
  Top 0.61: CMP82.1 465.45,360.68 497.84,360.68 CMP20.OUT_P
WR_RN_USING_RA__REG_REG
  Top 0.61: CMP82.5 443.23,360.68 400.69,360.68 CMP22.OUT_P
WR_RN_USING_RA__REG_REG_EXCEPTIONS_N
  Top 0.61: CMP65.P$12 350.52,313.69 400.69,313.69 CMP22.P$2
WR_RN_USING_RAC
  Top 0.61: CMP82.OUT_P 444.5,461.01 | 444.5,461.01 320.04,461.01 | 320.04,461.01 167.64,461.01 | 167.64,461.01 167.64,405.13 179.71,405.13 CMP69.P$2 | 167.64,461.01 149.22,461.01 CMP56.P$3 | CMP78.P$8 444.5,461.01 | CMP70.P$4 320.04,461.01
WR_RN_USING_RAC__MEM
  Top 0.61: CMP82.4 CMP80.OUT_P
WR_RN_USING_RI
  Top 0.61: CMP81.P$7 276.23,372.75 283.85,372.75 | 283.85,372.75 390.52,372.75 CMP75.P$4 | CMP50.OUT_P 283.85,372.75
(copper drawn outside any net)
  shapes: Top circle x146

## Text on the board
tPlace: Rn_ctrl(1) | Rnx_specials | Rn_ctrl(0) | Rc_ctrl | Export intermediary signals / for others to use | Gather signals for controlling the / Rx & Wn Multiplexors | Gather signals for controlling the / Rn Registers | r2_shift_in | 0 | 0 | ri_mux_2 | ri_mux_3 | ri_mux_h | rb_mux_0 | rb_mux_1 | rb_mux_2 | rb_mux_3 | ra_mux_0 | ra_mux_1 | ra_mux_2 | ra_mux_3 | r0_mux_Wn | r1_mux_Wn | r2_mux_Wn | r3_mux_Wn | ri_mux_sp | r1_mux_mul | Wn_mux_alu | Wn_mux_sxt | r0_mux_hold | r0_mux_add2 | r1_mux_hold | r1_mux_add2 | r2_mux_add2 | r2_mux_hold | r3_mux_add2 | r3_mux_hold | r0_mux_shift_1 | adder_x_special | adder_y_special | r2_mux_div_shift | r3_mux_div_shift | Wn_mux_shift_rac | add2_x_mux_ri__h | add2_x_mux_ri__sp | next_addr_mux_ri__sp | Wn_mux_0ext_mem_read | add2_x_mux_ri__sp__jsr_abs | not used | Decode H[1:0] to give Rx / with the shift value | Decode Instr[3:2] / to give RB | Decode Instr[1:0] / to give RA | Decode Instr[3:2] for / transfer size and direction | Instr | Instr_7_n | Instr_6_n | Instr_2_n | Instr_1_n | Instr_0_n | Instr_7 | Instr_3 | Instr_2 | Instr_1 | Instr_0 | State | State_15 | State_14 | State_13 | State_12 | State_11 | State_10 | State_8 | State_7 | State_6 | State_5 | State_4 | State_3 | State_1 | State_0 | General Registers (Rn) and Source Bus (RA, RB, RI & Wn) control | H_1 | H_0 | opcode_is_divs_state_0 | opcode_is_jsr_abs | is_end_n | opcode_is_stack_group | opcode_is_sqrt | opcode_is_stack_rel_state_2 | opcode_is_mul | opcode_is_move_r0_sp_state_0 | opcode_is_add_sp_state_2 | opcode_is_sxt | opcode_is_negx | opcode_is_muls | opcode_is_shift_bit | opcode_is_addx | opcode_is_subx | all_pops | R3_is_Z | R1_is_N | add1_is_N | arith_C | Flag_F0 | opcode_is_x_arith | opcode_is_postinc_group | load_weight | div_diff_sign | wr_WNusing_ra__reg_reg_exceptions_n | opcode_is_ldi_x | opcode_is_div_state_0 | div_by_zero_n | shift_is_shifting | wr_WN_using_ra_bit | opcode_is_div | opcode_is_pop_ps | opcode_is_ld_st | opcode_is_jsr_R0 | opcode_is_trap | opcode_is_indirect_postinc | Flag_D | Here we work out what data should be placed on the source buses at the start of a cycle and loaded into registers at the end. / This depends on the instruction in progress and the state we're in. As it happens the registers share many possible sources / so four of these are grouped and selected using the Wn multiplexer. For each source bus and register there are 4 options so / for each we generate 4 select lines. / We export some of the intermediary signals generated here for others to use. | PS | decode_general(1) | H | Rn_arith_ / flags | decode_ / general(0) | ALU_flags